# Altium schematic sheet 4.motor.SchDoc: 文档标题
size A4; DrawnBy: 创建者; Organization: Seneasy; DocumentNumber: 项目编号; Revision: 版本号; SheetNumber: 1; SheetTotal: 2; Time: 创建时间
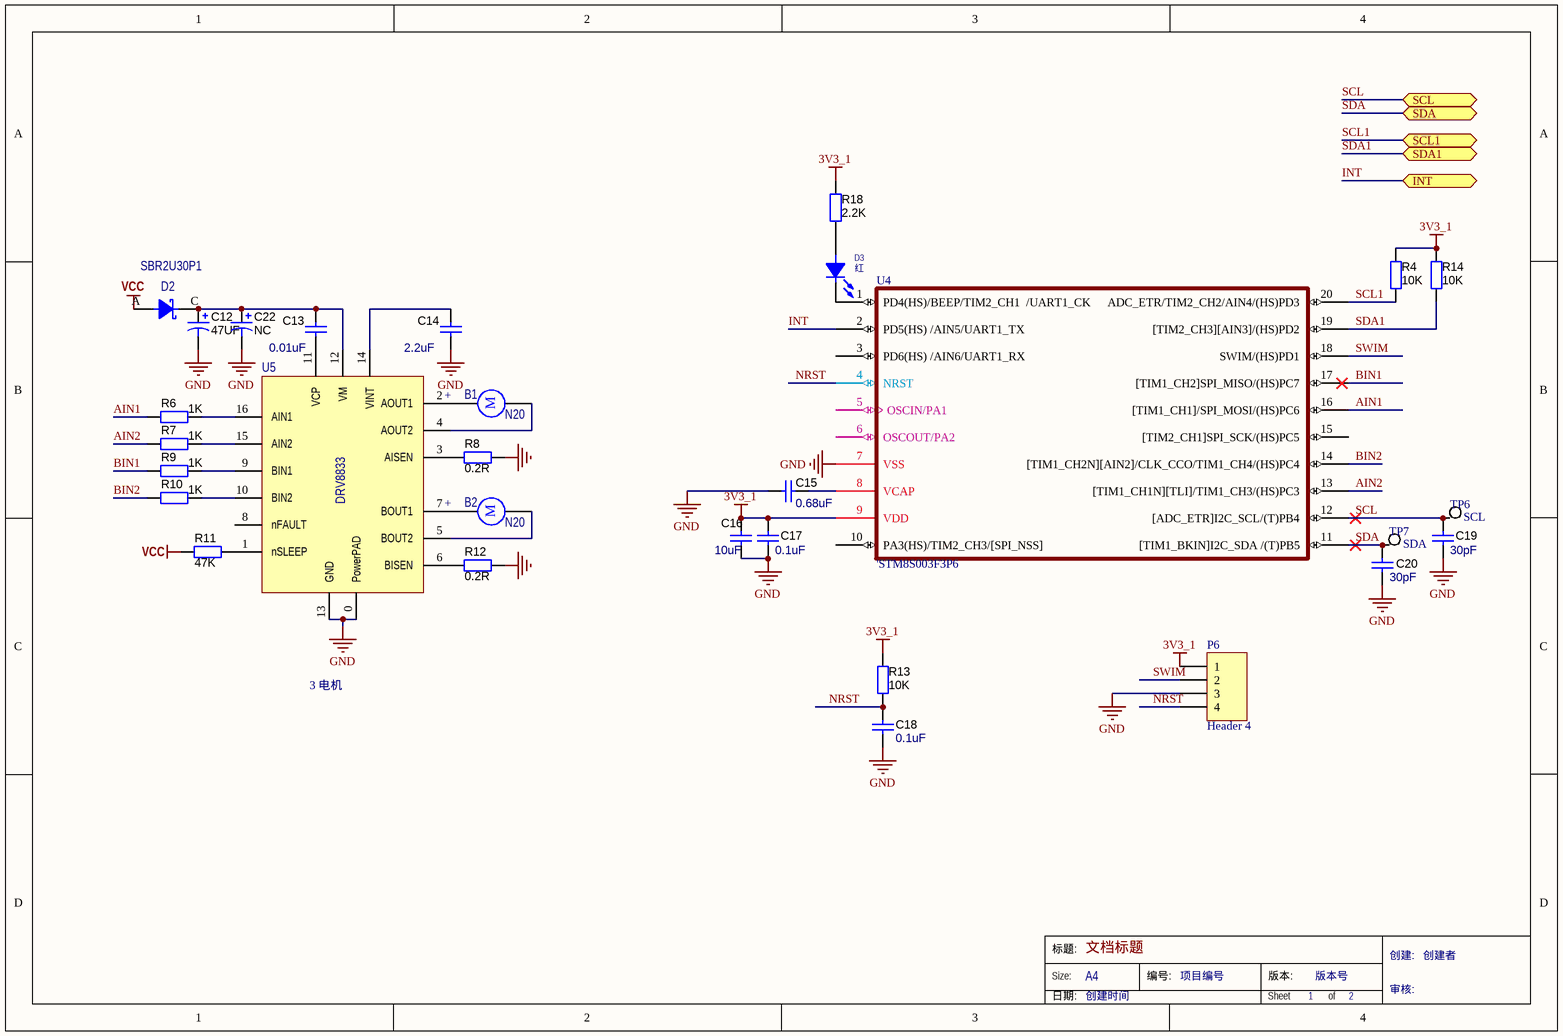
[diagram p0: 4.motor.SchDoc]

## Parts
B1  N20  [2PIN/2.54MM座子]
B2  N20  [2PIN/2.54MM座子]
C12  47UF  [0805]
C13  0.01uF  [0402]
C14  2.2uF  [0402]
C15  0.68uF  [0402]
C16  10uF  [0603]
C17  0.1uF  [0402]
C18  0.1uF  [0402]
C19  30pF  [0402]
C20  30pF  [0402]
C22  NC  [0805]
D2  SBR2U30P1  [POWERDI123]
D3  红  [0603LED]
P6  Header 4  [排针2.54MM/4PIN]
R4  10K  [0402]
R6  1K  [0402]
R7  1K  [0402]
R8  0.2R  [0603]
R9  1K  [0402]
R10  1K  [0402]
R11  47K  [0402]
R12  0.2R  [0603]
R13  10K  [0402]
R14  10K  [0402]
R18  2.2K  [0402]
TP6  SCL  [测试点]
TP7  SDA  [测试点]
U4  'STM8S003F3P6  [UFQFPN20]
U5  DRV8833  [HTSSOP -16(PWP)]

## Ports
INT (bidir), SCL1 (bidir), SCL (bidir), SDA1 (bidir), SDA (bidir)

## Nets
3V3_1: C16.1 C17.2 P6.1 R4.2 R13.1 R14.2 R18.1 U4.9(VDD)
GND: C12.2(-) C14.1 C15.2 C16.2 C17.1 C18.1 C19.1 C20.1 C22.2(-) P6.3 R8.2 R12.2 U4.7(VSS) U5.0(PowerPAD) U5.13(GND)
VCC: D2.A(ANODE) R11.1
AIN1: R6.1 U4.16([TIM1_CH1]/SPI_MOSI/(HS)PC6)
AIN2: R7.1 U4.13([TIM1_CH1N][TLI]/TIM1_CH3/(HS)PC3)
BIN1: R9.1 U4.17([TIM1_CH2]SPI_MISO/(HS)PC7)
BIN2: R10.1 U4.14([TIM1_CH2N][AIN2]/CLK_CCO/TIM1_CH4/(HS)PC4)
INT: U4.2(PD5(HS)_/AIN5/UART1_TX) ; port INT
NRST: C18.2 P6.4 R13.2 U4.4(NRST)
SCL: C19.2 TP6.1 U4.12([ADC_ETR]I2C_SCL/(T)PB4) ; port SCL
SCL1: R4.1 U4.20(ADC_ETR/TIM2_CH2/AIN4/(HS)PD3) ; port SCL1
SDA: C20.2 TP7.1 U4.11([TIM1_BKIN]I2C_SDA_/(T)PB5) ; port SDA
SDA1: R14.1 U4.19([TIM2_CH3][AIN3]/(HS)PD2) ; port SDA1
SWIM: P6.2 U4.18(SWIM/(HS)PD1)
NetB1_1: B1.1 U5.2(AOUT1)
NetB1_2: B1.2 U5.4(AOUT2)
NetB2_1: B2.1 U5.7(BOUT1)
NetB2_2: B2.2 U5.5(BOUT2)
NetC12_1: C12.1(+) C13.2 C22.1(+) D2.C(CATHODE) U5.12(VM)
NetC13_1: C13.1 U5.11(VCP)
NetC14_2: C14.2 U5.14(VINT)
NetC15_1: C15.1 U4.8(VCAP)
NetD3_A: D3.A(ANODE) R18.2
NetD3_C: D3.C(CATHODE) U4.1(PD4(HS)/BEEP/TIM2_CH1__/UART1_CK)
NetR6_2: R6.2 U5.16(AIN1)
NetR7_2: R7.2 U5.15(AIN2)
NetR8_1: R8.1 U5.3(AISEN)
NetR9_2: R9.2 U5.9(BIN1)
NetR10_2: R10.2 U5.10(BIN2)
NetR11_2: R11.2 U5.1(nSLEEP)
NetR12_1: R12.1 U5.6(BISEN)

Not connected (* = marked no-connect by the designer): U4 3(PD6(HS)_/AIN6/UART1_RX) 5(OSCIN/PA1) 6(OSCOUT/PA2) 10(PA3(HS)/TIM2_CH3/[SPI_NSS]) 15([TIM2_CH1]SPI_SCK/(HS)PC5); U5 8(nFAULT)

## Notes on the sheet
- +
- 3 电机
- 标题:
- Size:
- A4
- 编号:
- 版本:
- 创建:
- 日期:
- Sheet
- of
- 审核:
- (in symbol Motor) M

## Library data of the parts
B1 B2 = Motor: Motor, General Kind; Published: 24-Mar-1999; LatestRevisionDate: 17-Jul-2002; LatestRevisionNote: Re-released for DXP Platform.; PackageReference: RB5-10.5; Publisher: Altium Limited; PackageDescription: Capacitor (Radial); 2 Leads
C12 C22 = CAP3_pol: CAP ALUM 22UF 10V 20% SMD; PartNumber: EEE-1AA220WR; Manufacturer: Panasonic - ECG; Polarized: Y; CompType: Capacitor; U/M: EA; Cap_F: 0.000022; Tolerance_%: 20; VDC_V: 10; IRMS_A: 0.03; TaMin_C: -40; TaMax_C: 105; Cap_Case: E55; SymbolVersion: 2008-07-09; RoHS: Y; Value1: ?; Value2: 10V; MountType: SMT; Technology: AL; Series: MVE; Published: 2008-06-19; Publisher: National Semiconductor; LatestRevisionDate: 2011-09-19; LatestRevisionNote: Removed DigiKeyPartNumber parameter.; ComponentLink1Description: Datasheet link; Alternate PartNumber: -; Alternate Manufacturer: -; Supplier Part Number 1: PCE3869CT-ND; PackageReference: 1206
  C12: Value: 47UF
  C22: Value: NC
C13-C20 = CAP1_npol: CAP, CERM, 0.01uF, 100V, +/-5%, X7R, 0603; PartNumber: 06031C103JAT2A; Manufacturer: AVX; Polarized: N; Tolerance: 5; ESR_Ohm: 0.098; Voltage Rating DC: 25V; RoHS Compliant: Y; MountType: SMT; Dielectric: X7R; ComponentLink1URL: http://www.avx.com/docs/masterpubs/smccp.pdf; Operating Temperature: -55+125C; PackageReference: 0603
  C13: Value: 0.01uF
  C14: Value: 2.2uF
  C15: Value: 0.68uF
  C16: Value: 10uF
  C17 C18: Value: 0.1uF
  C19 C20: Value: 30pF
D2 = Diode_Schottky: Published: 8-Jun-2000; LatestRevisionDate: 17-Jul-2002; LatestRevisionNote: Re-released for DXP Platform.; PackageReference: SMB; Publisher: Altium Limited; PackageDescription: DO-214-AA/SMB; 2 C-Bend Leads; Body 5.3 x 3.6 mm, inc. leads (LxW); Code_JEDEC: DO-214-AA; Value: ?; PartNumber: ?; Manufacturer: ?
D3 = LED1: Manufacturer: ?; PackageReference: ?; PartNumber: ?; Value: ?
P6 = Header 4: Header, 4-Pin; LatestRevisionDate: 17-Jul-2002; LatestRevisionNote: Re-released for DXP Platform.; Publisher: Altium Limited
R4 R6-R14 R18 = RES1: RES, 1.0k ohm, 5%, 0.1W, 0603; PartNumber: RC0603JR-071KL; Manufacturer: Yageo America; CompType: Resistor; Res_ohm: 1000; Value_Code: 1k00; Tolerance_%: 5; Power_W: 0.1; VDC_V: 50; TempCo: 100 ppm/C; EIA_Code: E24; U/M: EA; SymbolVersion: 2009-05-29; RoHS: Y; Value1: 5%; Value2: 0.1W; MountType: SMT; Technology: Thick Film; Published: 2008-06-26; Publisher: Texas Instruments; LatestRevisionDate: 2014-04-18; ComponentLink1Description: Datasheet link; ComponentLink1URL: http://www.yageo.com/pdf/Pu-RC0603_51_PbFree_L_2.pdf; Supplier Part Number 1: 311-1.0KGRCT-ND; Supplier 2: Mouser; Supplier Part Number 2: 603-RC0603JR-071KL; Supplier 3: Farnell; Supplier Part Number 3: 9233385; PackageReference: 0603
  R4 R13 R14: Value: 10K
  R6 R7 R9 R10: Value: 1K
  R8 R12: Value: 0.2R
  R11: Value: 47K
  R18: Value: 2.2K
TP6 TP7 = TP: Test Point
U4 = STM8S103F2P6: ST 8-bit  Microcontroller
U5 = DRV8833PWP: DUAL H-BRIDGE MOTOR DRIVER